# EAGLE design rapidshark-dart-detector-backlight-mk-2.0 (EAGLE 6.5.0)
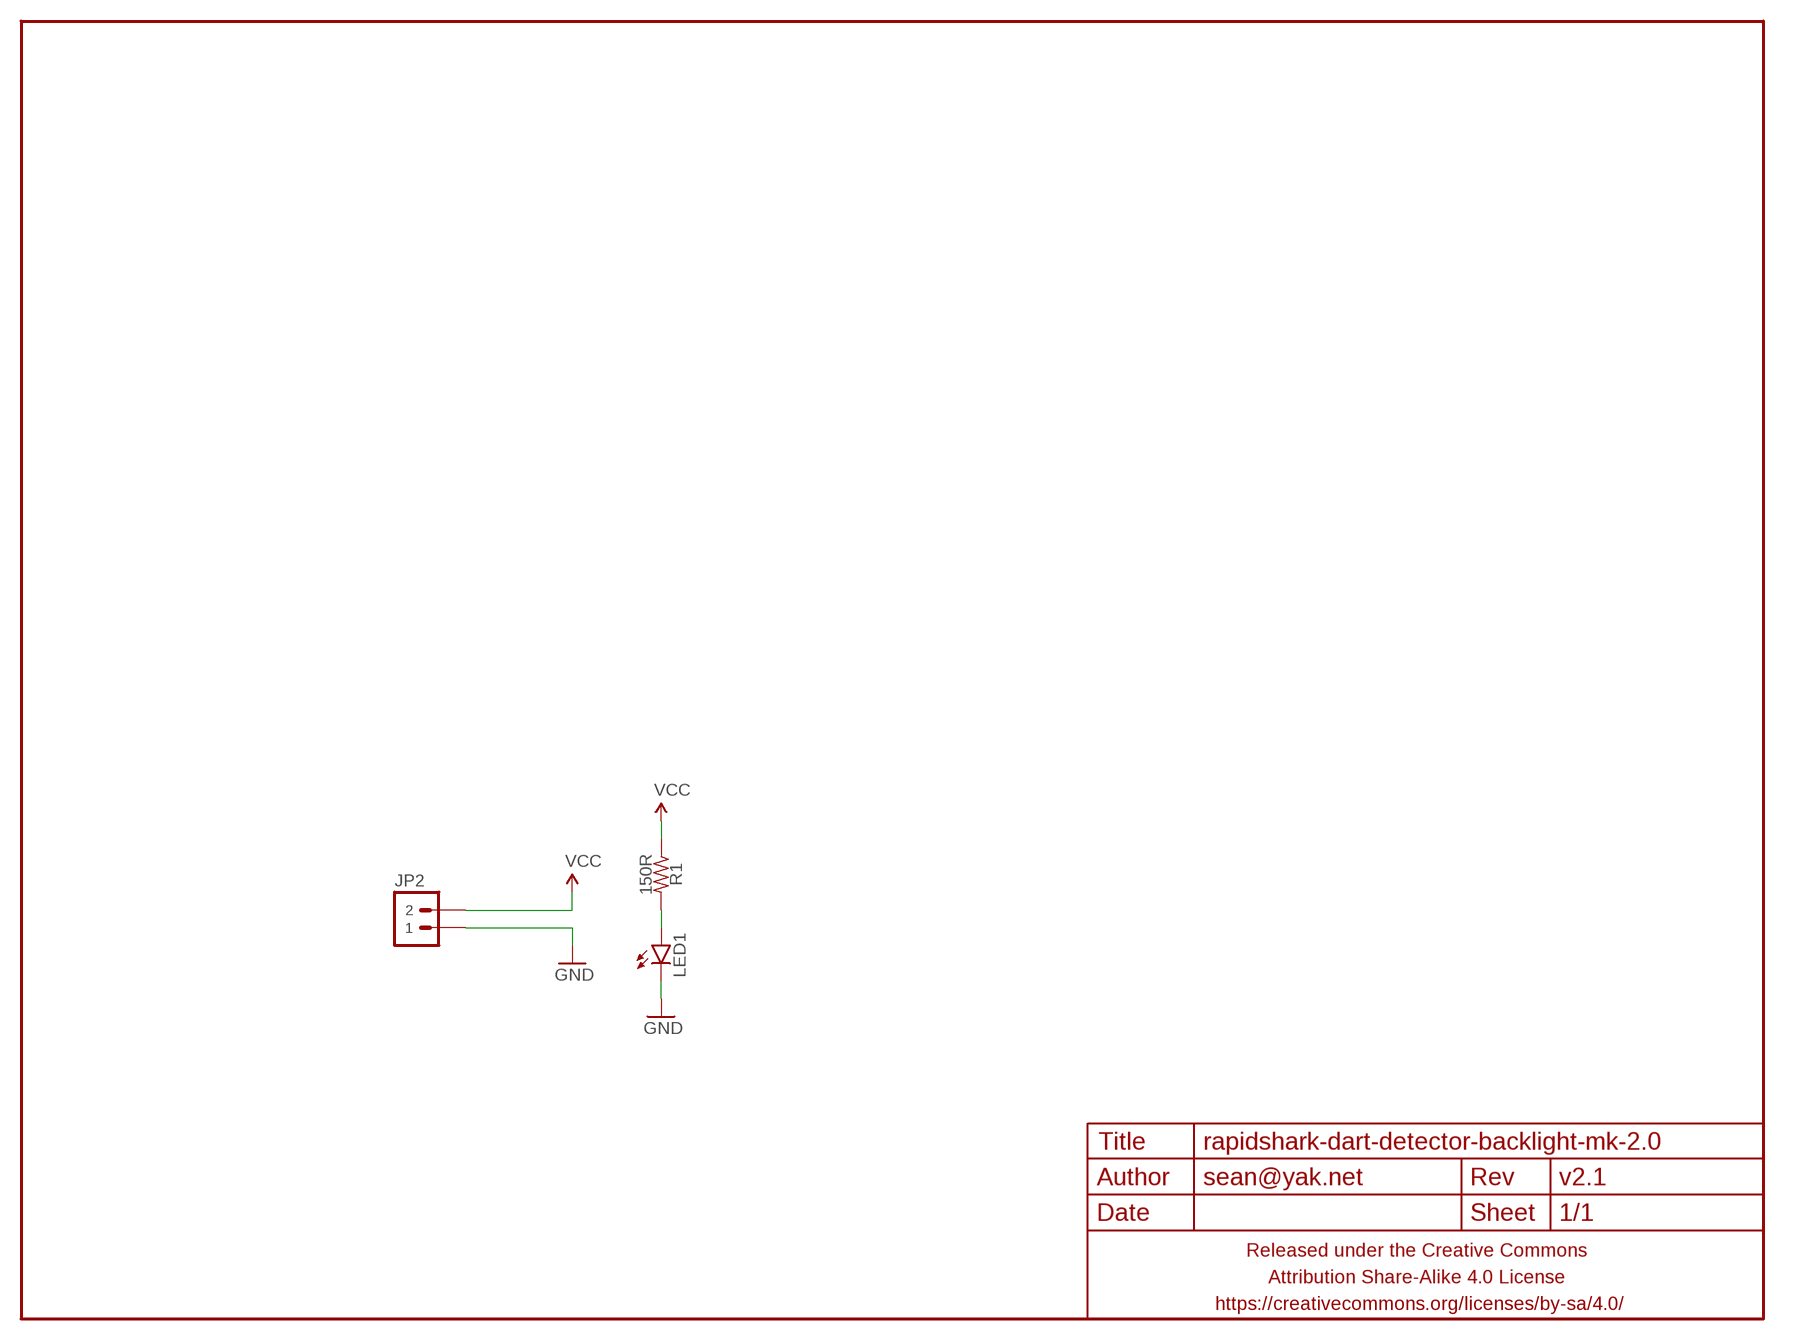
[diagram p0: schematic, sheet 1]

## Parts
FRAME1  FRAME-LETTERNO_PACKAGE  [DUMMY]
JP2  M02JST-PTH-RA-R+  [JST-2-PH-RA-PTH-R+]
LED1  LED5MM_SHORTPADS  [LED5MM_SHORTPADS]
R1  150R  RESISTORPTH-AXIAL-6.35MM  [RESISTOR-AXIAL-PTH-6.35MM]

## Nets
GND: JP2.1 LED1.K(C)
N$1: LED1.A R1.P$2
VCC: JP2.2 R1.P$1

## Library data of the parts
FRAME1 = A_butts:FRAME-LETTER: Schematic Frame Standard 8.5x11 US Letter frame; DESIGNER: sean@yak.net; VERSION: v2.1
JP2 = A_butts:M02: Standard 2-pin 0.1" header. Use with - straight break away headers ( PRT-00116) - right angle break away headers (PRT-00553) - swiss pins (PRT-00743) - machine pins (PRT-00117) - female headers (PRT-00115) Molex polarized connector foot print use with: PRT-08233 with associated crimp pins and housings. 2.54_SCREWTERM for use with PRT-10571. 3.5mm Screw Terminal footprints for PRT-08084 5mm Screw Terminal footprints for use with PRT-08433
LED1 = A_butts:LED: LEDs Standard schematic elements and footprints for 5mm, 3mm, 1206, and 0603 sized LEDs. 5mm - Spark Fun Electronics SKU : COM-00529 (and others)
R1 = A_butts:RESISTOR: RESISTOR, American symbol

## Board
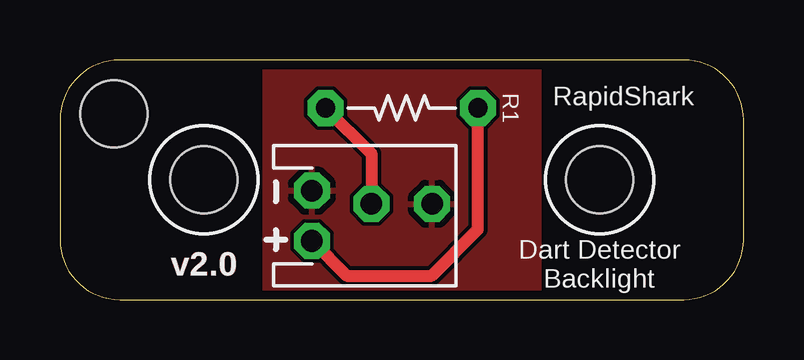
[diagram p1: board, top side]
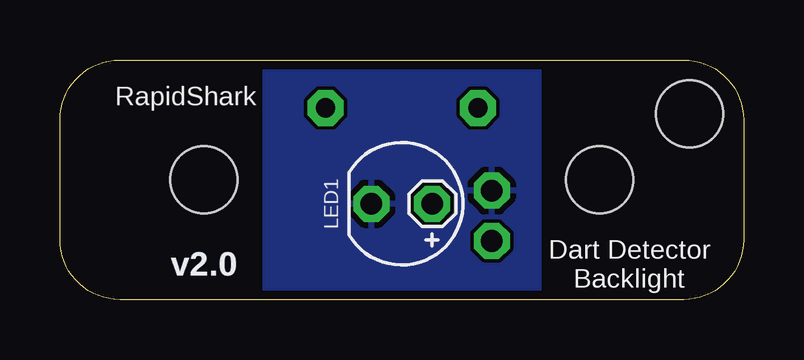
[diagram p2: board, bottom side, seen from below]

Size 28.5 x 10 mm. Coordinates in mm from the lower left corner, seen from the top.
Outline: 28.5,2.5 28.5,7.5 arc90 26,10 2.5,10 arc90 0,7.5 0,2.5 arc90 2.5,0 26,0 arc90 28.5,2.5
Copper layers (1*16): Top 0.0356mm / dielectric 1.5011mm / Bottom 0.0356mm
Design rules "LaenPCBOrder2": minimum track width 6mil, minimum drill 13mil, track to track 6mil, track to pad 6mil, pad to pad 6mil, via to via 6mil, smd to smd 6mil, copper to edge 15mil, drill to drill 6mil, minimum pad ring 7mil, minimum via ring 7mil, stop-mask expansion 3mil, vias tented up to drill 20mil, thermal gap 10mil
Holes 2.8 mm at 22.5,5 6,5 2.25,7.75

### Footprints (pad centres in the part's own frame; a part is rotated, then mirrored left to right if it is on the bottom)
JST-2-PH-RA-PTH-R+ = drill 0.9 pad 1.5 octagon: 1 -1.05,0; 2 1.05,0
LED5MM_SHORTPADS = drill 0.9 pad 1.5 octagon: A -1.27,0; K 1.27,0
RESISTOR-AXIAL-PTH-6.35MM = drill 0.8 pad 1.5 octagon: P$1 -3.175,0; P$2 3.175,0

### Placement (x,y rotation side)
FRAME1  0,0 180 top
JP2  10.5,3.5 270 top
LED1  14.25,4 180 bottom
R1  14.25,8 180 top

### Tracks (layer width: path | path; a pad name or v marks a point on that pad's centre or on a via)
GND
  pour Bottom (rank 5): 20,0 8.5,0 8.5,10 20,10
  pour Top (rank 5): 20,0 8.5,0 8.5,10 20,10
N$1
  Top 0.508: R1.P$2 12.98,6.09 LED1.A
VCC
  Top 0.508: JP2.2 11.95,1 15.5,1 17.43,2.92 R1.P$1

### Text on the board
tPlace: RapidShark | Dart Detector / Backlight
bPlace: RapidShark | Dart Detector / Backlight